# EAGLE design sensor-dht22 (EAGLE 5.12)
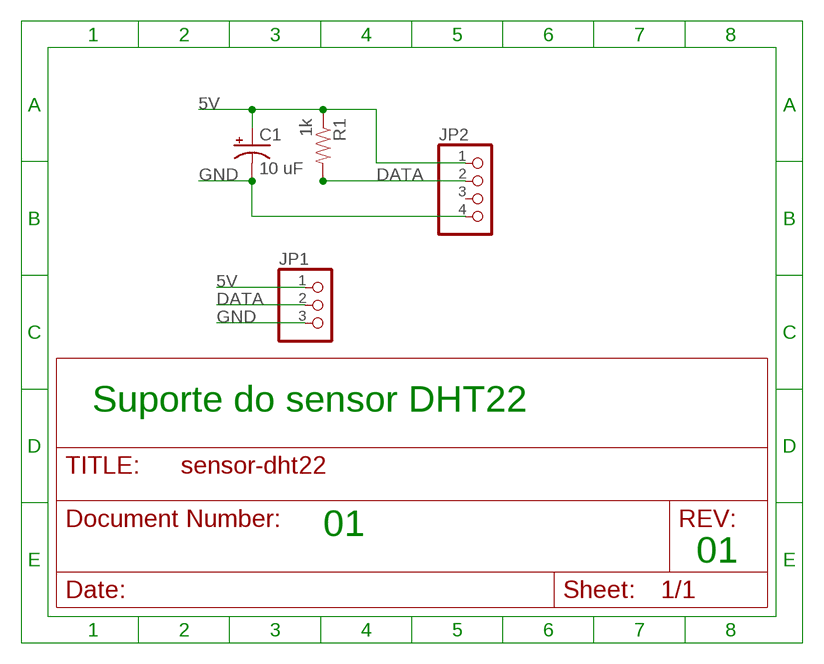
[diagram p0: schematic, sheet 1]

## Parts
C1  10 uF  CAP_POLPTH2  [CPOL-RADIAL-10UF-25V]
JP1  PINHD-1X3  [1X03]
JP2  PINHD-1X4  [1X04]
R1  1k  RESISTORPTH-1/4W  [AXIAL-0.4]

## Nets
5V: C1.1(+) JP1.1 JP2.1 R1.P$1
DATA: JP1.2 JP2.2 R1.P$2
GND: C1.2(-) JP1.3 JP2.4
Unconnected: JP2.3

## Notes on the sheet
- Suporte do sensor DHT22
- 01
- 01

## Library data of the parts
C1 = SparkFun:CAP_POL: Capacitor Polarized These are standard SMD and PTH capacitors. Normally 10uF, 47uF, and 100uF in electrolytic and tantalum varieties. Always verify the external diameter of the through hole cap, it varies with capacity, voltage, and manufacturer. The EIA devices should be standard.
JP1 = pinhead:PINHD-1X3: PIN HEADER
JP2 = pinhead:PINHD-1X4: PIN HEADER
R1 = SparkFun:RESISTOR: Resistor Basic schematic elements and footprints for 0603, 1206, and PTH resistors.

## Board
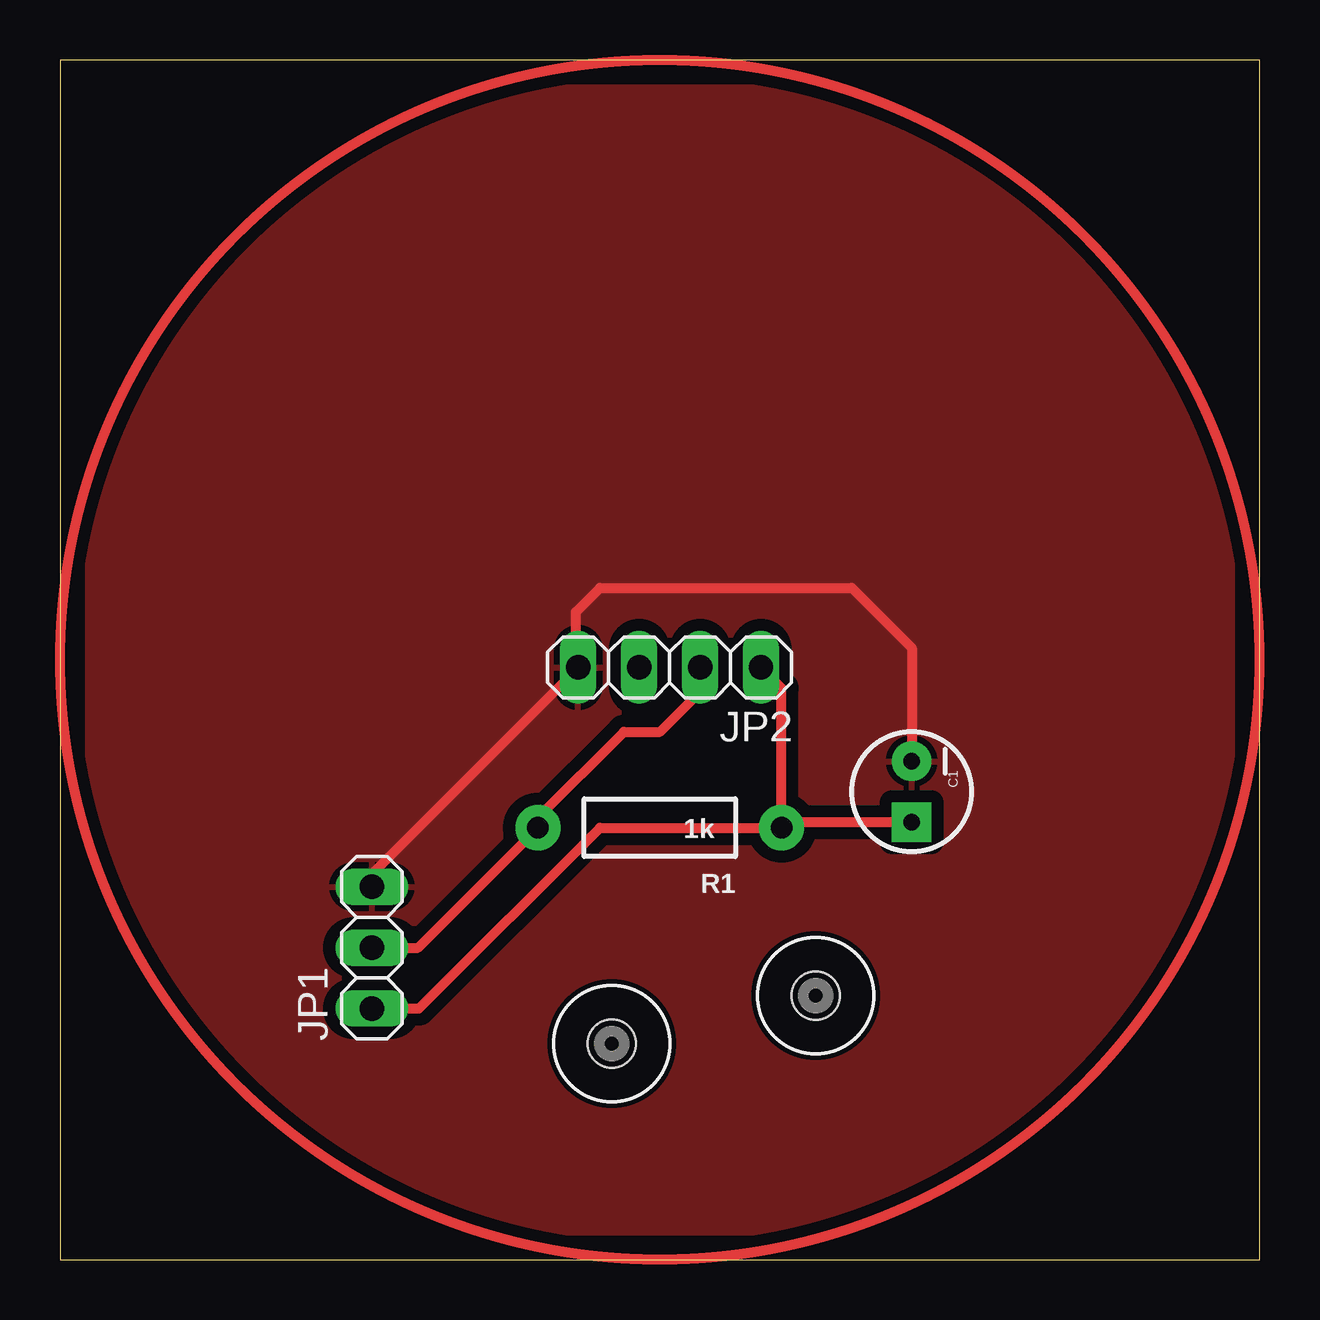
[diagram p1: board, top side]

Size 50 x 50 mm. Coordinates in mm from the lower left corner, seen from the top.
Outline: 0,0 50,0 50,50 0,50 0,0
Copper layers (1*16): Top 0.035mm / dielectric 1.5mm / Bottom 0.035mm
Design rules "default *": minimum track width 10mil, minimum drill 24mil, track to track 20mil, track to pad 20mil, pad to pad 20mil, via to via 20mil, smd to smd 20mil, copper to edge 40mil, drill to drill 8mil, minimum pad ring 10mil, minimum via ring 8mil, stop-mask expansion 4mil, vias tented up to drill 0mil, thermal gap 10mil

### Footprints (pad centres in the part's own frame; a part is rotated, then mirrored left to right if it is on the bottom)
CPOL-RADIAL-10UF-25V = drill 0.7 pad 1.651 square: 1 1.27,0 | drill 0.7 pad 1.651 round: 2 -1.27,0
1X03 = drill 1.016 long: 1 -2.54,0; 2 0,0; 3 2.54,0
1X04 = drill 1.016 long: 1 -3.81,0; 2 -1.27,0; 3 1.27,0; 4 3.81,0
AXIAL-0.4 = drill 0.9 pad 1.88 round: P$1 -5.08,0; P$2 5.08,0
DRIL-2 = hole 2: 0,0

### Placement (x,y rotation side)
C1  35.5,19.5 270 top
JP1  13,13 90 top
JP2  25.41,24.68 180 top
R1  25,18 180 top
U$1  [DRIL-2]  23,9 0 top
U$2  [DRIL-2]  31.5,11 0 top

### Tracks (layer width: path | path; a pad name or v marks a point on that pad's centre or on a via)
5V
  Top 0.406: JP1.1 14.96,10.46 22.5,18 R1.P$1 | R1.P$1 30.08,23.82 JP2.1 | C1.1 30.31,18.23 R1.P$1
DATA
  Top 0.406: JP1.2 14.92,13 R1.P$2 19.92,18.42 23.5,22 25,22 26.5,23.5 26.5,24.5 JP2.2
GND
  Top 0.406: JP1.3 13,16.08 21.21,24.29 21.5,24.58 | 21.5,24.58 JP2.4 | C1.2 35.5,25.5 33,28 22.5,28 21.5,27 21.5,24.58
  pour Top: 0,0 0,50 50,50 50,48 50,0
(copper drawn outside any net)
  shapes: Top circle x1